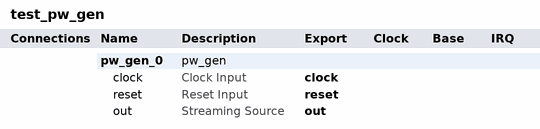
[diagram p0: system contents]
# Platform Designer (Qsys) system test_pw_gen, Cyclone V 5CEBA2F17A7
# Parameters at their usual value, and those the tool derives, are not listed.
package require qsys
create_system test_pw_gen
set_project_property DEVICE_FAMILY {Cyclone V}
set_project_property DEVICE 5CEBA2F17A7

add_instance pw_gen_0 pw_gen 1.0

# exported interfaces
add_interface clock clock sink
set_interface_property clock EXPORT_OF pw_gen_0.clock
add_interface out avalon_streaming source
set_interface_property out EXPORT_OF pw_gen_0.out
add_interface reset reset sink
set_interface_property reset EXPORT_OF pw_gen_0.reset

set_interconnect_requirement {$system} qsys_mm.clockCrossingAdapter HANDSHAKE
set_interconnect_requirement {$system} qsys_mm.enableEccProtection FALSE
set_interconnect_requirement {$system} qsys_mm.insertDefaultSlave FALSE
set_interconnect_requirement {$system} qsys_mm.maxAdditionalLatency 1

save_system test_pw_gen.qsys
